# Altium schematic sheet Constant_Voltage_schematic_2022-05-03.schdoc
size 293 x 189 mm
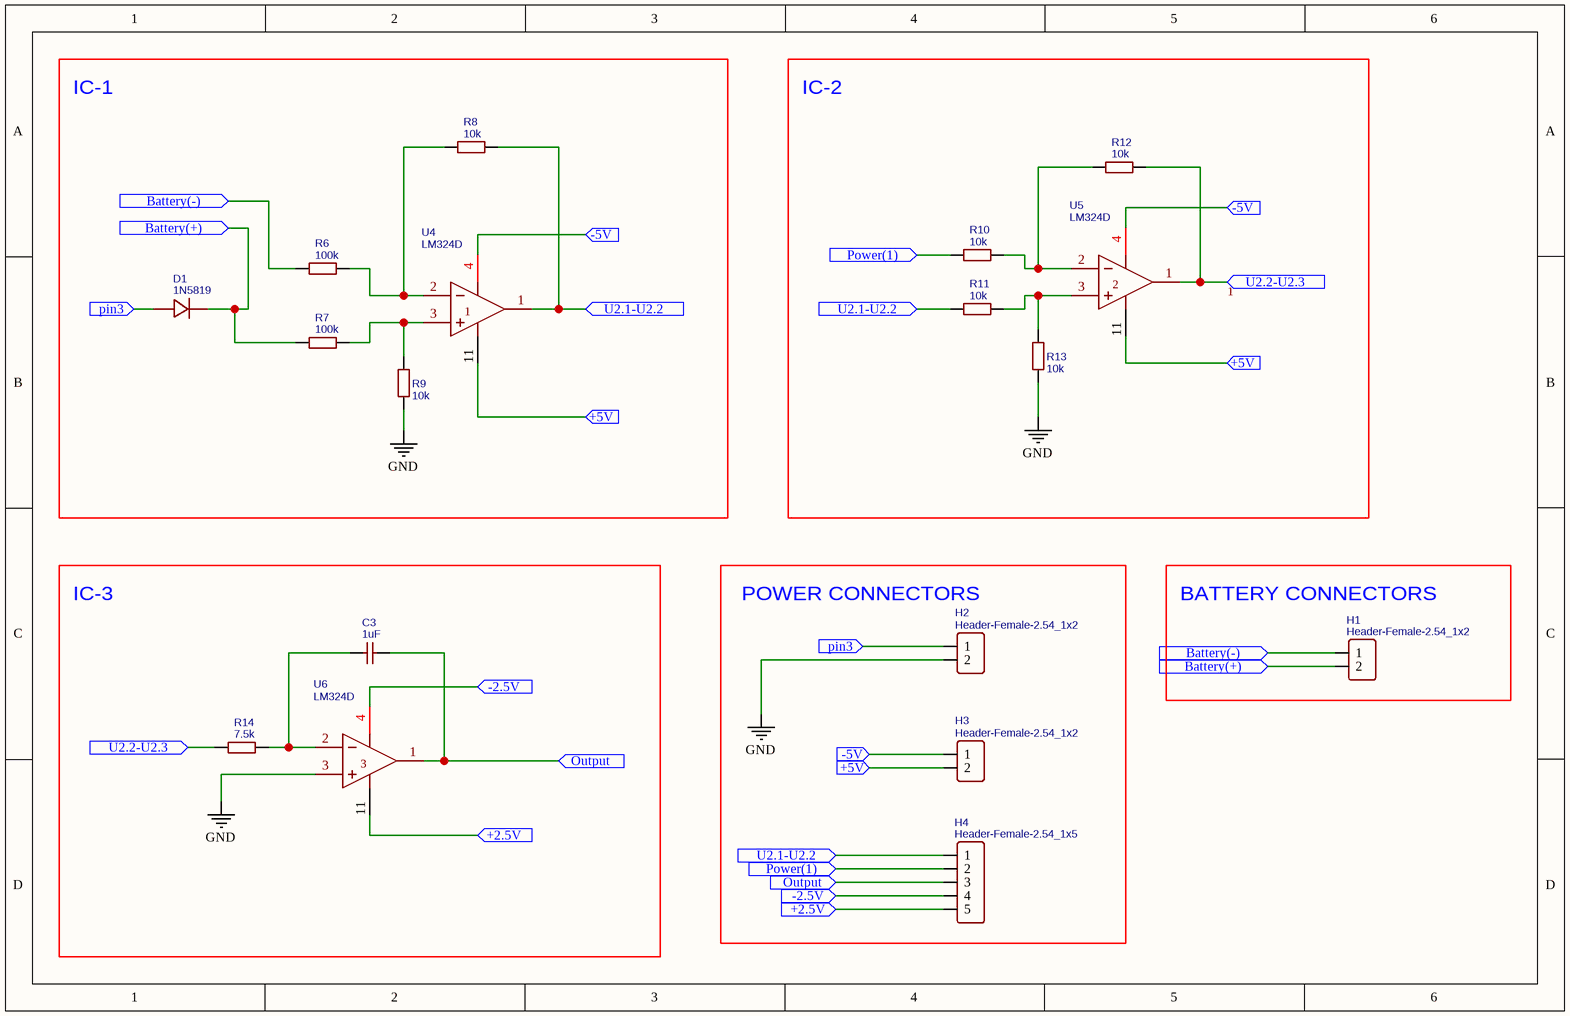
[diagram p0: Constant_Voltage_schematic_2022-05-03.schdoc]

## Parts
C3  1uF  [CAP-TH_L3.5-W3.0-P2.54-D0.8]
D1  1N5819  [DO-41_BD2.4-L4.7-P8.70-D0.9-RD]
H1  Header-Female-2.54_1x2  [HDR-TH_2P-P2.54-V-F]
H2  Header-Female-2.54_1x2  [HDR-TH_2P-P2.54-V-F]
H3  Header-Female-2.54_1x2  [HDR-TH_2P-P2.54-V-F]
H4  Header-Female-2.54_1x5  [HDR-TH_5P-P2.54-V-F]
R6  100k  [AXIAL-0.4]
R7  100k  [AXIAL-0.4]
R8  10k  [AXIAL-0.4]
R9  10k  [AXIAL-0.4]
R10  10k  [AXIAL-0.4]
R11  10k  [AXIAL-0.4]
R12  10k  [AXIAL-0.4]
R13  10k  [AXIAL-0.4]
R14  7.5k  [AXIAL-0.4]
U4  LM324D  [SO-14_L8.9-W3.9-P1.27-LS6.0-BL]
U5  LM324D  [SO-14_L8.9-W3.9-P1.27-LS6.0-BL]
U6  LM324D  [SO-14_L8.9-W3.9-P1.27-LS6.0-BL]

## Blocks framed on the sheet
IC-1: D1 R6-R9 U4
IC-2: R10-R13 U5
IC-3: C3 R14 U6
POWER CONNECTORS: H2-H4
BATTERY CONNECTORS: H1

## Ports
+2.5V (in), +5V (in), -2.5V (in), -5V (in), Battery(+) (in), Battery(-) (in), Output (in), pin3 (in), Power(1) (in), U2.1-U2.2 (in), U2.2-U2.3 (in)

## Nets
GND: H2.2 R9.1 R13.1 U6.3(IN1+)
+2.5V: H4.5 U6.11(VCC-) ; port +2.5V
+5V: H3.2 U4.11(VCC-) U5.11(VCC-) ; port +5V
-2.5V: H4.4 U6.4(VCC+) ; port -2.5V
-5V: H3.1 U4.4(VCC+) U5.4(VCC+) ; port -5V
Battery(+): D1.1(K) H1.2 R7.1 ; port Battery(+)
Battery(-): H1.1 R6.1 ; port Battery(-)
Output: C3.2 H4.3 U6.1(OUT1) ; port Output
pin3: D1.2(A) H2.1 ; port pin3
Power(1): H4.2 R10.1 ; port Power(1)
U2.1-U2.2: H4.1 R8.2 R11.1 U4.1(OUT1) ; port U2.1-U2.2
U2.2-U2.3: R12.2 R14.1 U5.1(OUT1) ; port U2.2-U2.3
NetC3_1: C3.1 R14.2 U6.2(IN1-)
NetR6_2: R6.2 R8.1 U4.2(IN1-)
NetR7_2: R7.2 R9.2 U4.3(IN1+)
NetR10_2: R10.2 R12.1 U5.2(IN1-)
NetR11_2: R11.2 R13.2 U5.3(IN1+)

## Notes on the sheet
- (near U5) 2

## Library data of the parts
C3 = 1uF: BOM_Manufacturer: ReliaPro; BOM_Manufacturer Part: 22pf/50V 10%; nameAlias: Capacitance; BOM_Supplier: LCSC; BOM_Supplier Part: C9316; spicePre: C; spiceSymbolName: 22pF
D1 = 1N5819: BOM_Manufacturer: GD; Contributor: LCSC; BOM_Supplier: LCSC; BOM_Supplier Part: C256527; BOM_Manufacturer Part: 1N5819; BOM_JLCPCB Part Class: Extended Part; spicePre: D; spiceSymbolName: 1N5819_C256527
H1-H3 = Header-Female-2.54_1x2: BOM_Manufacturer: BOOMELE; BOM_Manufacturer Part: 2.54-1*2PFemale; BOM_Supplier: LCSC; BOM_Supplier Part: C49661; BOM_JLCPCB Part Class: Extended Part; spicePre: P; spiceSymbolName: Header-Female-2.54_1x2
H4 = Header-Female-2.54_1x5: BOM_Manufacturer: BOOMELE; BOM_Manufacturer Part: 2.54mm 1*5p Female header; BOM_Supplier: LCSC; BOM_Supplier Part: C50950; BOM_JLCPCB Part Class: Extended Part; spicePre: H; spiceSymbolName: Header-Female-2.54_1x5
R6 R7 = 100k: BOM_Manufacturer: UniOhm; BOM_Manufacturer Part: MFR0W4F2200A50; Power: 1/4W; Tolerance: ±1%; BOM_EasyEDA: E57439; Value: Value; BOM_Supplier Part: E57439; BOM_Supplier: EasyEDA; spicePre: R; spiceSymbolName: RESISTOR
R8-R13 = 10k: BOM_Manufacturer: UniOhm; BOM_Manufacturer Part: MFR0W4F2200A50; Power: 1/4W; Tolerance: ±1%; BOM_EasyEDA: E57439; Value: Value; BOM_Supplier Part: E57439; BOM_Supplier: EasyEDA; spicePre: R; spiceSymbolName: RESISTOR
R14 = 7.5k: BOM_Manufacturer: UniOhm; BOM_Manufacturer Part: MFR0W4F2200A50; Power: 1/4W; Tolerance: ±1%; BOM_EasyEDA: E57439; Value: Value; BOM_Supplier Part: E57439; BOM_Supplier: EasyEDA; spicePre: R; spiceSymbolName: RESISTOR
U4-U6 = LM324D: BOM_Manufacturer: ST(意法半导体); subpart_no: 1; Contributor: LCSC; BOM_Supplier: LCSC; BOM_Supplier Part: C2935189; BOM_Manufacturer Part: LM324D; spicePre: U; spiceSymbolName: LM324D